# Altium schematic sheet Curtch_Sheet.SchDoc
size A4
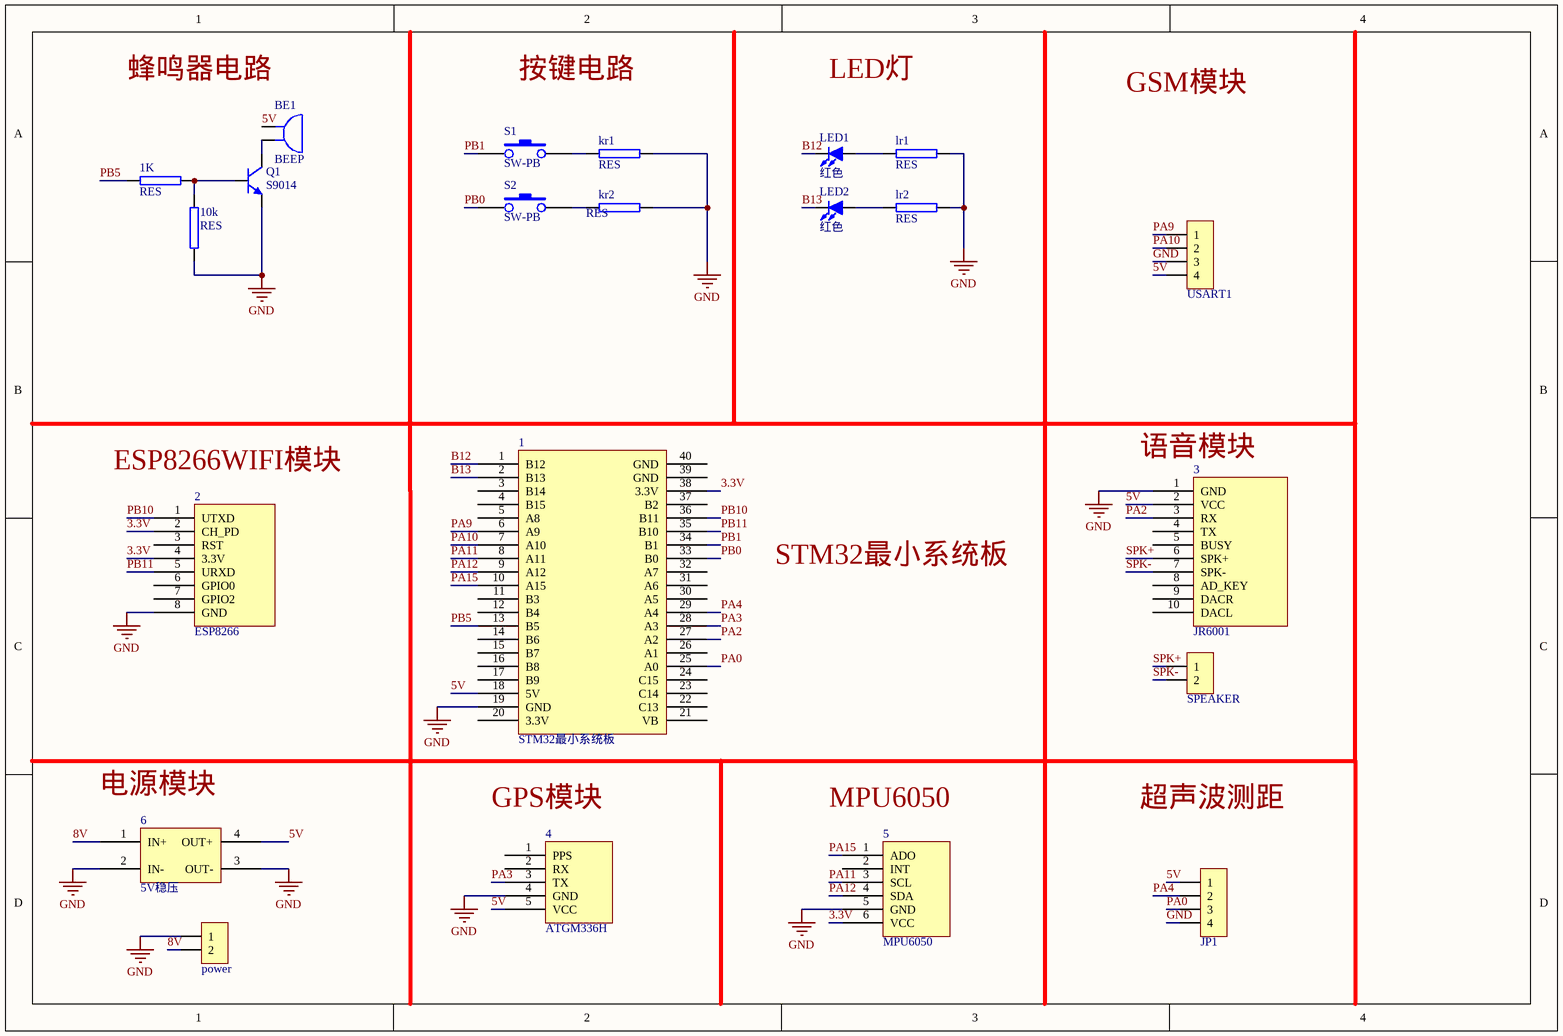
[diagram p0: Curtch_Sheet.SchDoc]

## Parts
1  STM32最小系统板  [DIP40]
1K  RES  [AXIAL0.4]
2  ESP8266  [DIP8 - duplicate]
3  JR6001  [DIP20]
4  ATGM336H  [DIP10]
5  MPU6050  [MPU6050]
6  5V稳压  [DIP16]
10k  RES  [AXIAL0.4]
BE1  BEEP  [BEEP 7.6x12x7.5]
JP1  HDR-1X4  [HDR2.54-LI-4P]  (value not drawn)
kr1  RES  [AXIAL0.4]
kr2  RES  [AXIAL0.4]
LED1  红色  [LED 5MM-B]
LED2  红色  [LED 5MM-B]
lr1  RES  [AXIAL0.4]
lr2  RES  [AXIAL0.4]
power  HDR-1X2  [HDR2.54-Y-LI-2P]  (value not drawn)
Q1  S9014  [TO92A]
S1  SW-PB  [SW6*6]
S2  SW-PB  [SW6*6]
SPEAKER  HDR-1X2  [HDR2.54-Y-LI-2P]  (value not drawn)
USART1  HDR-1X4  [HDR2.54-Y-LI-4P]  (value not drawn)

## Nets
GND: 1.19(GND) 2.8(GND) 3.1(GND) 4.4(GND) 5.5(GND) 6.2(IN-) 6.3(OUT-) 10k.2 JP1.4 kr1.2 kr2.2 lr1.2 lr2.2 power.1 Q1.1(E) USART1.3
3.3V: 1.38(3.3V) 2.2(CH_PD) 2.4(3.3V) 5.6(VCC)
5V: 1.18(5V) 3.2(VCC) 4.5(VCC) 6.4(OUT+) BE1.1 JP1.1 USART1.4
8V: 6.1(IN+) power.2
B12: 1.1(B12) LED1.2(K)
B13: 1.2(B13) LED2.2(K)
PA0: 1.25(A0) JP1.3
PA2: 1.27(A2) 3.3(RX)
PA3: 1.28(A3) 4.3(TX)
PA4: 1.29(A4) JP1.2
PA9: 1.6(A9) USART1.1
PA10: 1.7(A10) USART1.2
PA11: 1.8(A11) 5.3(SCL)
PA12: 1.9(A12) 5.4(SDA)
PA15: 1.10(A15) 5.1(ADO)
PB0: 1.33(B0) S2.1
PB1: 1.34(B1) S1.1
PB5: 1.13(B5) 1K.1
PB10: 1.36(B11) 2.1(UTXD)
PB11: 1.35(B10) 2.5(URXD)
SPK+: 3.6(SPK+) SPEAKER.1
SPK-: 3.7(SPK-) SPEAKER.2
Net1K_2: 1K.2 10k.1 Q1.2(B)
NetBE1_2: BE1.2 Q1.3(C)
Netkr1_1: kr1.1 S1.2
Netkr2_1: kr2.1 S2.2
NetLED1_1: LED1.1(A) lr1.1
NetLED2_1: LED2.1(A) lr2.1

Not connected (* = marked no-connect by the designer): 1 3(B14) 4(B15) 5(A8) 11(B3) 12(B4) 14(B6) 15(B7) 16(B8) 17(B9) 20(3.3V) 21(VB) 22(C13) 23(C14) 24(C15) 26(A1) 30(A5) 31(A6) 32(A7) 37(B2) 39(GND) 40(GND); 2 3(RST) 6(GPIO0) 7(GPIO2); 3 4(TX) 5(BUSY) 8(AD_KEY) 9(DACR) 10(DACL); 4 1(PPS) 2(RX); 5 2(INT)

## Notes on the sheet
- 蜂鸣器电路
- 按键电路
- LED灯
- GSM模块
- (near 2) ESP8266WIFI模块
- (near 3) 语音模块
- STM32最小系统板
- (near 6) 电源模块
- GPS模块
- (near 5) MPU6050
- 超声波测距

## Library data of the parts
2 = Component_1
JP1 USART1 = Header 4: 4P接插件; 版权归属: 源创客; BOM名称: 4P接插件; 学习资源: www.ooocke.com
LED1 LED2 = LED-5MM: 5mm插件LED; 版权归属: 源创客; BOM名称: 5mm插件LED; 学习资源: www.ooocke.com
power SPEAKER = Header 2: 2P接插件; 版权归属: 源创客; BOM名称: 2P接插件; 学习资源: www.ooocke.com
Q1 = 9014-DIP: 低噪放大-NPN型; 版权归属: 源创客; 属性: 50V 0.1A 0.4W 150MHZ; BOM名称: 低噪放大-NPN型; 学习资源: www.ooocke.com